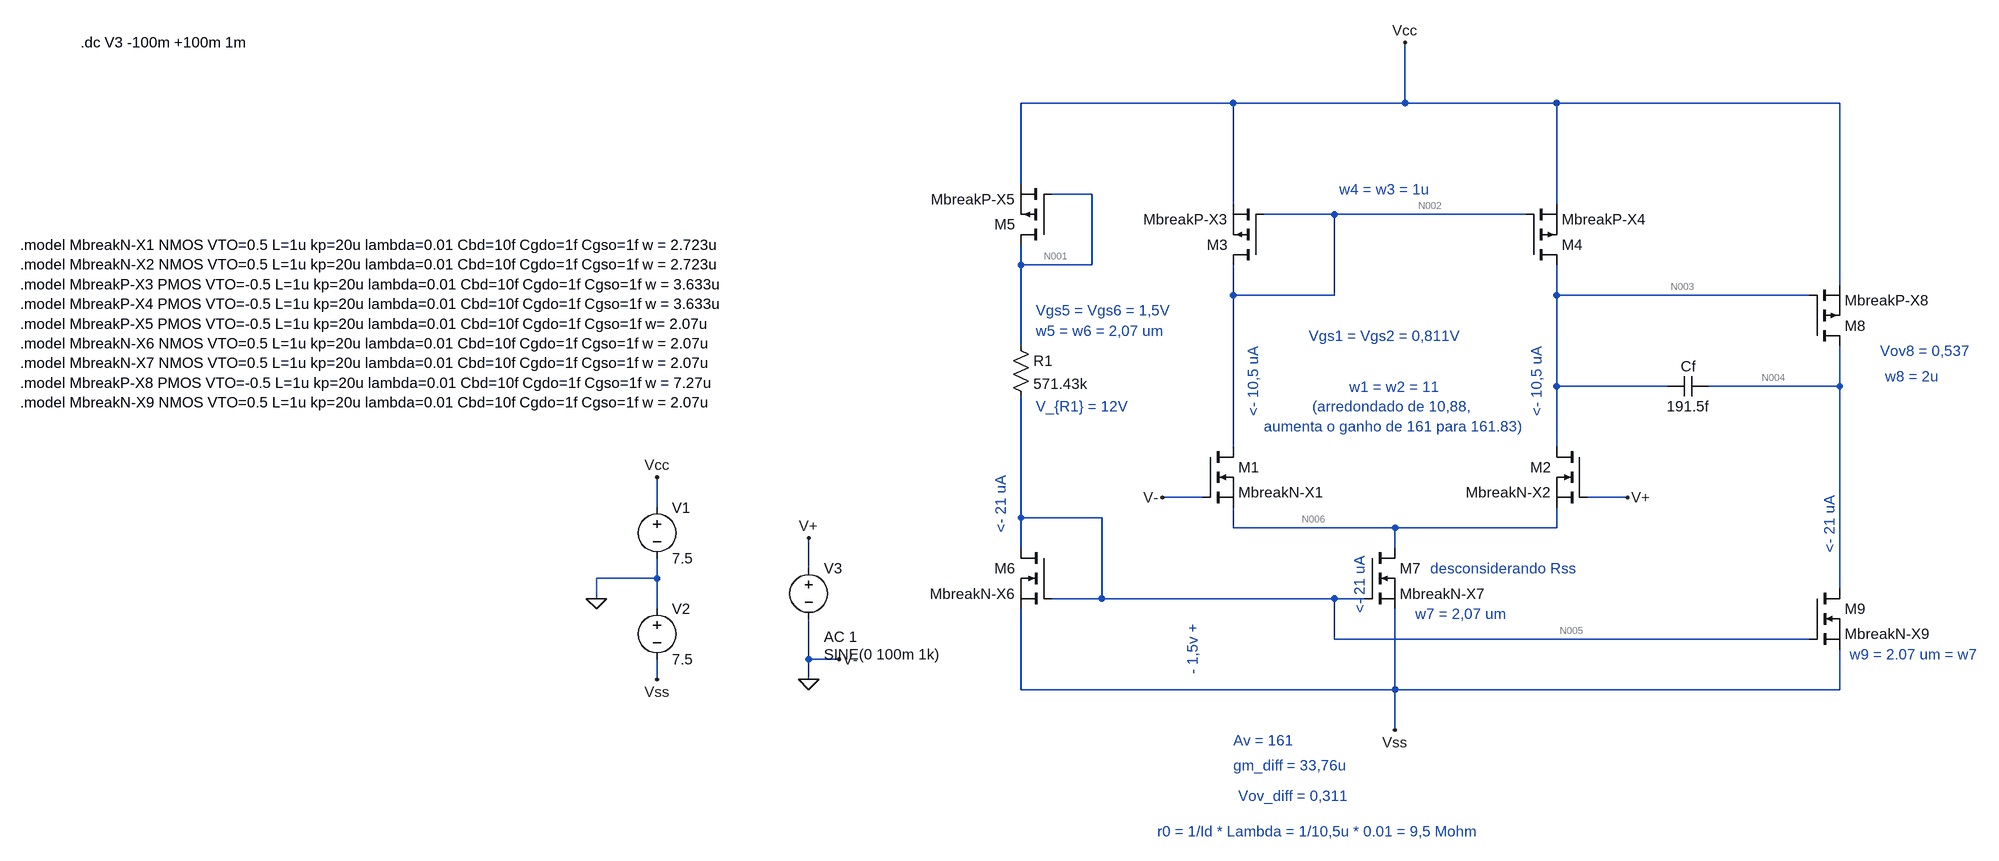
[diagram p0: schematic SIMULAÇÃO.asc]
SIMULAÇÃO.asc, the LTspice schematic file:
Version 4.1
SHEET 1 3020 808
WIRE 1216 -640 880 -640
WIRE 1488 -640 1488 -736
WIRE 1488 -640 1216 -640
WIRE 1728 -640 1488 -640
WIRE 2176 -640 1728 -640
WIRE 880 -512 880 -640
WIRE 992 -496 928 -496
WIRE 1216 -480 1216 -640
WIRE 1728 -480 1728 -640
WIRE 1376 -464 1264 -464
WIRE 1680 -464 1376 -464
WIRE 880 -384 880 -416
WIRE 992 -384 992 -496
WIRE 992 -384 880 -384
WIRE 2176 -352 2176 -640
WIRE 1216 -336 1216 -384
WIRE 1376 -336 1376 -464
WIRE 1376 -336 1216 -336
WIRE 1728 -336 1728 -384
WIRE 2128 -336 1728 -336
WIRE 880 -256 880 -384
WIRE 1728 -192 1728 -336
WIRE 1904 -192 1728 -192
WIRE 2176 -192 2176 -256
WIRE 2176 -192 1968 -192
WIRE 1216 -96 1216 -336
WIRE 1728 -96 1728 -192
WIRE 1168 -16 1104 -16
WIRE 1840 -16 1776 -16
WIRE 304 0 304 -48
WIRE 880 16 880 -176
WIRE 1008 16 880 16
WIRE 1216 32 1216 0
WIRE 1472 32 1216 32
WIRE 1728 32 1728 0
WIRE 1728 32 1472 32
WIRE 880 64 880 16
WIRE 1472 64 1472 32
WIRE 544 96 544 48
WIRE 304 112 304 80
WIRE 304 112 208 112
WIRE 2176 128 2176 -192
WIRE 208 144 208 112
WIRE 1008 144 1008 16
WIRE 1008 144 928 144
WIRE 1376 144 1008 144
WIRE 1424 144 1376 144
WIRE 304 160 304 112
WIRE 1376 208 1376 144
WIRE 2128 208 1376 208
WIRE 544 240 544 176
WIRE 592 240 544 240
WIRE 304 272 304 240
WIRE 544 272 544 240
WIRE 880 288 880 160
WIRE 1472 288 1472 160
WIRE 1472 288 880 288
WIRE 2176 288 2176 224
WIRE 2176 288 1472 288
WIRE 1472 352 1472 288
FLAG 304 -48 Vcc
FLAG 304 272 Vss
FLAG 208 144 0
FLAG 544 272 0
FLAG 592 240 V-
FLAG 544 48 V+
FLAG 1840 -16 V+
FLAG 1104 -16 V-
FLAG 1488 -736 Vcc
FLAG 1472 352 Vss
SYMBOL voltage 304 -16 R0
WINDOW 123 0 0 Left 0
WINDOW 39 0 0 Left 0
SYMATTR InstName V1
SYMATTR Value 7.5
SYMBOL voltage 304 144 R0
WINDOW 123 0 0 Left 0
WINDOW 39 0 0 Left 0
SYMATTR InstName V2
SYMATTR Value 7.5
SYMBOL voltage 544 80 R0
WINDOW 3 24 152 Left 2
WINDOW 123 24 124 Left 2
WINDOW 39 0 0 Left 0
SYMATTR Value SINE(0 100m 1k)
SYMATTR Value2 AC 1
SYMATTR InstName V3
SYMBOL pmos 928 -416 R180
SYMATTR InstName M5
SYMATTR Value MbreakP-X5
SYMBOL res 864 -272 R0
SYMATTR InstName R1
SYMATTR Value 571.43k
SYMBOL nmos 928 64 M0
SYMATTR InstName M6
SYMATTR Value MbreakN-X6
SYMBOL nmos 1424 64 R0
SYMATTR InstName M7
SYMATTR Value MbreakN-X7
SYMBOL nmos 1168 -96 R0
SYMATTR InstName M1
SYMATTR Value MbreakN-X1
SYMBOL nmos 1776 -96 M0
SYMATTR InstName M2
SYMATTR Value MbreakN-X2
SYMBOL pmos 1264 -384 R180
SYMATTR InstName M3
SYMATTR Value MbreakP-X3
SYMBOL pmos 1680 -384 M180
SYMATTR InstName M4
SYMATTR Value MbreakP-X4
SYMBOL pmos 2128 -256 M180
SYMATTR InstName M8
SYMATTR Value MbreakP-X8
SYMBOL nmos 2128 128 R0
SYMATTR InstName M9
SYMATTR Value MbreakN-X9
SYMBOL cap 1968 -208 R90
WINDOW 0 0 32 VBottom 2
WINDOW 3 32 32 VTop 2
SYMATTR InstName Cf
SYMATTR Value 191.5f
TEXT 904 -312 Left 2 ;Vgs5 = Vgs6 = 1,5V
TEXT 904 -160 Left 2 ;V_{R1} = 12V
TEXT 904 -280 Left 2 ;w5 = w6 = 2,07 um
TEXT 1152 264 VLeft 2 ;- 1,5v +
TEXT 1248 -144 VLeft 2 ;<- 10,5 uA
TEXT 848 40 VLeft 2 ;<- 21 uA
TEXT 1096 512 Left 2 ;r0 = 1/Id * Lambda = 1/10,5u * 0.01 = 9,5 Mohm
TEXT 1224 456 Left 2 ;Vov_diff = 0,311
TEXT 1216 408 Left 2 ;gm_diff = 33,76u
TEXT 1216 368 Left 2 ;Av = 161
TEXT 1528 96 Left 2 ;desconsiderando Rss
TEXT 1336 -272 Left 2 ;Vgs1 = Vgs2 = 0,811V
TEXT 1472 -160 Center 2 ;w1 = w2 = 11\n(arredondado de 10,88, \naumenta o ganho de 161 para 161.83)
TEXT -704 -416 Left 2 !.model MbreakN-X1 NMOS VTO=0.5 L=1u kp=20u lambda=0.01 Cbd=10f Cgdo=1f Cgso=1f w = 2.723u\n.model MbreakN-X2 NMOS VTO=0.5 L=1u kp=20u lambda=0.01 Cbd=10f Cgdo=1f Cgso=1f w = 2.723u\n.model MbreakP-X3 PMOS VTO=-0.5 L=1u kp=20u lambda=0.01 Cbd=10f Cgdo=1f Cgso=1f w = 3.633u\n.model MbreakP-X4 PMOS VTO=-0.5 L=1u kp=20u lambda=0.01 Cbd=10f Cgdo=1f Cgso=1f w = 3.633u\n.model MbreakP-X5 PMOS VTO=-0.5 L=1u kp=20u lambda=0.01 Cbd=10f Cgdo=1f Cgso=1f w= 2.07u\n.model MbreakN-X6 NMOS VTO=0.5 L=1u kp=20u lambda=0.01 Cbd=10f Cgdo=1f Cgso=1f w = 2.07u\n.model MbreakN-X7 NMOS VTO=0.5 L=1u kp=20u lambda=0.01 Cbd=10f Cgdo=1f Cgso=1f w = 2.07u\n.model MbreakP-X8 PMOS VTO=-0.5 L=1u kp=20u lambda=0.01 Cbd=10f Cgdo=1f Cgso=1f w = 7.27u\n.model MbreakN-X9 NMOS VTO=0.5 L=1u kp=20u lambda=0.01 Cbd=10f Cgdo=1f Cgso=1f w = 2.07u
TEXT 2240 -248 Left 2 ;Vov8 = 0,537
TEXT 2160 72 VLeft 2 ;<- 21 uA
TEXT 1504 168 Left 2 ;w7 = 2,07 um
TEXT 2192 232 Left 2 ;w9 = 2.07 um = w7
TEXT 1416 168 VLeft 2 ;<- 21 uA
TEXT 1696 -144 VLeft 2 ;<- 10,5 uA
TEXT 2248 -208 Left 2 ;w8 = 2u
TEXT 1384 -504 Left 2 ;w4 = w3 = 1u
TEXT -608 -736 Left 2 !.dc V3 -100m +100m 1m

The netlist it stands for:
* SIMULAÇÃO.asc
V1 Vcc 0 7.5
V2 0 Vss 7.5
V3 V+ 0 SINE(0 100m 1k) AC 1
M5 N001 N001 Vcc Vcc MbreakP-X5
R1 N001 N005 571.43k
M6 N005 N005 Vss Vss MbreakN-X6
M7 N006 N005 Vss Vss MbreakN-X7
M1 N002 0 N006 N006 MbreakN-X1
M2 N003 V+ N006 N006 MbreakN-X2
M3 N002 N002 Vcc Vcc MbreakP-X3
M4 N003 N002 Vcc Vcc MbreakP-X4
M8 N004 N003 Vcc Vcc MbreakP-X8
M9 N004 N005 Vss Vss MbreakN-X9
Cf N004 N003 191.5f
.model NMOS NMOS
.model PMOS PMOS
.lib standard.mos
* Vgs5 = Vgs6 = 1,5V
* V_{R1} = 12V
* w5 = w6 = 2,07 um
* - 1,5v +
* <- 10,5 uA
* <- 21 uA
* r0 = 1/Id * Lambda = 1/10,5u * 0.01 = 9,5 Mohm
* Vov_diff = 0,311
* gm_diff = 33,76u
* Av = 161
* desconsiderando Rss
* Vgs1 = Vgs2 = 0,811V
* w1 = w2 = 11
* (arredondado de 10,88,
* aumenta o ganho de 161 para 161.83)
.model MbreakN-X1 NMOS VTO=0.5 L=1u kp=20u lambda=0.01 Cbd=10f Cgdo=1f Cgso=1f w = 2.723u
.model MbreakN-X2 NMOS VTO=0.5 L=1u kp=20u lambda=0.01 Cbd=10f Cgdo=1f Cgso=1f w = 2.723u
.model MbreakP-X3 PMOS VTO=-0.5 L=1u kp=20u lambda=0.01 Cbd=10f Cgdo=1f Cgso=1f w = 3.633u
.model MbreakP-X4 PMOS VTO=-0.5 L=1u kp=20u lambda=0.01 Cbd=10f Cgdo=1f Cgso=1f w = 3.633u
.model MbreakP-X5 PMOS VTO=-0.5 L=1u kp=20u lambda=0.01 Cbd=10f Cgdo=1f Cgso=1f w= 2.07u
.model MbreakN-X6 NMOS VTO=0.5 L=1u kp=20u lambda=0.01 Cbd=10f Cgdo=1f Cgso=1f w = 2.07u
.model MbreakN-X7 NMOS VTO=0.5 L=1u kp=20u lambda=0.01 Cbd=10f Cgdo=1f Cgso=1f w = 2.07u
.model MbreakP-X8 PMOS VTO=-0.5 L=1u kp=20u lambda=0.01 Cbd=10f Cgdo=1f Cgso=1f w = 7.27u
.model MbreakN-X9 NMOS VTO=0.5 L=1u kp=20u lambda=0.01 Cbd=10f Cgdo=1f Cgso=1f w = 2.07u
* Vov8 = 0,537
* <- 21 uA
* w7 = 2,07 um
* w9 = 2.07 um = w7
* <- 21 uA
* <- 10,5 uA
* w8 = 2u
* w4 = w3 = 1u
.dc V3 -100m +100m 1m
.backanno
.end

* Results of the author's LTspice run, read from the files saved beside the schematic
* Operating Point, zero values left out:
*   V(vss) = -7.5 V
*   V(n001) = 6 V
*   V(n005) = -6 V
*   V(n002) = 6.452 V
*   V(vcc) = 7.5 V
*   V(n006) = -1.113 V
*   V(n003) = 6.452 V
*   V(n004) = 2.797 V
*   I(V1) = -65.83 µA
*   Id(M6) = 21 µA
*   Is(M6) = -21 µA
*   Ib(M6) = -1.51 pA
*   Id(M1) = 11.01 µA
*   Is(M1) = -11.01 µA
*   Ib(M1) = -7.575 pA
*   Id(M4) = -11.01 µA
*   Is(M4) = 11.01 µA
*   Ib(M4) = 1.058 pA
*   I(R1) = 21 µA
*   Id(M9) = 22.82 µA
*   Is(M9) = -22.82 µA
*   Ib(M9) = -10.31 pA
*   Id(M5) = -21 µA
*   Is(M5) = 21 µA
*   Ib(M5) = 1.51 pA
*   Id(M7) = 22.01 µA
*   Is(M7) = -22.01 µA
*   Ib(M7) = -6.397 pA
*   I(V2) = -65.83 µA
*   Id(M2) = 11.01 µA
*   Is(M2) = -11.01 µA
*   Ib(M2) = -7.575 pA
*   Id(M3) = -11.01 µA
*   Is(M3) = 11.01 µA
*   Ib(M3) = 1.058 pA
*   Id(M8) = -22.82 µA
*   Is(M8) = 22.82 µA
*   Ib(M8) = 4.713 pA
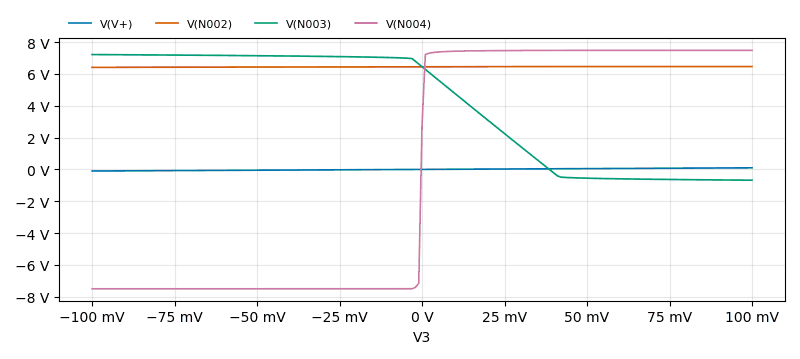
[diagram p1: DC transfer characteristic of SIMULAÇÃO.asc, plotted from the saved traces]
* DC transfer characteristic, 1 run:
*   V(V+): -100 mV at V3=-100 mV, 100 mV at V3=100 mV, min -100 mV, max 100 mV
*   V(N002): 6.411 V at V3=-100 mV, 6.462 V at V3=100 mV, min 6.411 V, max 6.462 V
*   V(N003): 7.216 V at V3=-100 mV, -677.9 mV at V3=100 mV, min -677.9 mV, max 7.216 V
*   V(N004): -7.5 V at V3=-100 mV, 7.479 V at V3=100 mV, min -7.5 V, max 7.479 V